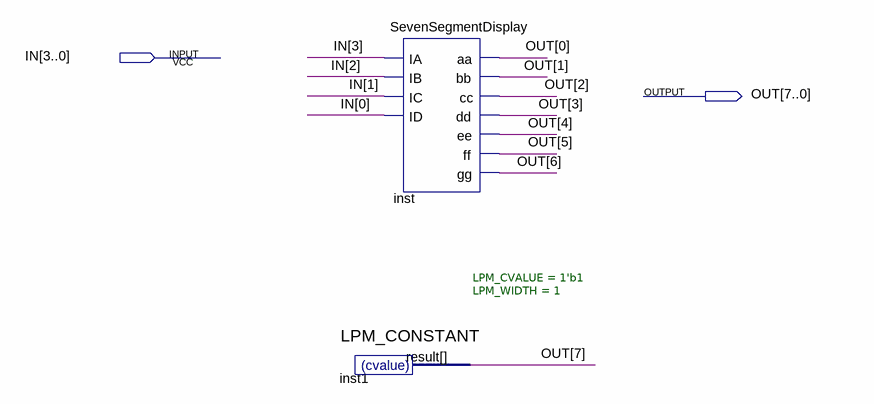
[diagram p0: schematic sheet]
// Quartus schematic SevenSegmentPro.bdf as structural Verilog: 2 symbols, 2 pins
module SevenSegmentPro (
  input  [3:0] IN,
  output [7:0] OUT
);

  LPM_CONSTANT #(.LPM_CVALUE(1'b1), .LPM_WIDTH(1)) inst1 (.result(OUT[7]));
  SevenSegmentDisplay inst (
    .IA(IN[3]), .IB(IN[2]), .IC(IN[1]), .ID(IN[0]), .aa(OUT[0]), .bb(OUT[1]), .cc(OUT[2]), .dd(OUT[3]),
    .ee(OUT[4]), .ff(OUT[5]), .gg(OUT[6]));
endmodule
